# EAGLE schematic Timer (EAGLE 9.6.2)
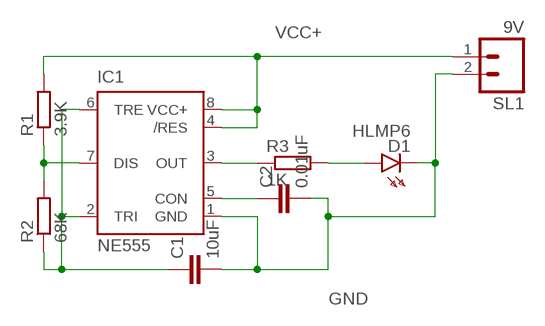
[diagram p0: schematic, sheet 1]

## Parts
C1  10uF  C-EU025-025X050  [C025-025X050]
C2  0.01uF  C-EU025-025X050  [C025-025X050]
D1  HLMP6  [HLMP6]
IC1  NE555  [DIL-08]
R1  3.9K  R-EU_0204/7  [0204/7]
R2  68K  R-EU_0204/7  [0204/7]
R3  1K  R-EU_0204/7  [0204/7]
SL1  9V  M02  [02P]

## Nets
GND: C1.2 C2.2 D1.K IC1.1(GND) SL1.2
N$1: C1.1 IC1.2(TRI) IC1.6(TRE) R2.1
N$2: IC1.7(DIS) R1.1 R2.2
N$4: C2.1 IC1.5(CON)
N$6: IC1.3(OUT) R3.1
N$7: D1.A R3.2
VCC+: IC1.4(/RES) IC1.8(VCC+) R1.2 SL1.1

## Library data of the parts
C1 C2 = rcl:C-EU: CAPACITOR, European symbol; SPICEPREFIX: C
D1 = display-hp:HLMP6: LED 2mm horizontal; MF: AGILENT TECHNOLOGIES; MPN: HLMP-6500; OC_FARNELL: 1652490; OC_NEWARK: 40K0088
IC1 = st-microelectronics:NE555: General purpose bipolar Timer; MF: Arrow Electronics; MPN: NE555N; OC_FARNELL: 1467742; OC_NEWARK: 89K1486
R1-R3 = rcl:R-EU_: RESISTOR, European symbol; SPICEPREFIX: R
SL1 = con-amp-quick:M02: AMP QUICK CONNECTOR; OC_FARNELL: unknown; OC_NEWARK: unknown